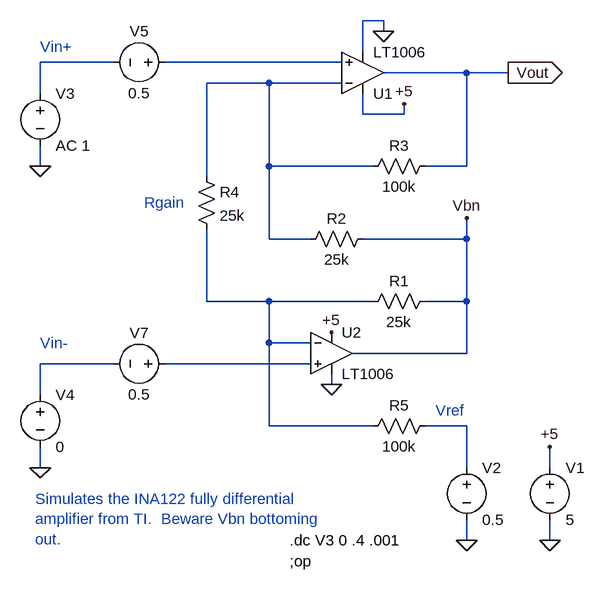
[diagram p0: schematic diffamp_vref.asc]
diffamp_vref.asc, the LTspice schematic file:
Version 4
SHEET 1 880 680
WIRE 224 -288 192 -288
WIRE 224 -272 224 -288
WIRE 192 -240 192 -288
WIRE -192 -224 -304 -224
WIRE 160 -224 -112 -224
WIRE 352 -208 224 -208
WIRE 416 -208 352 -208
WIRE 48 -192 -48 -192
WIRE 160 -192 48 -192
WIRE -304 -176 -304 -224
WIRE 192 -144 192 -176
WIRE 256 -144 256 -160
WIRE 256 -144 192 -144
WIRE -304 -64 -304 -96
WIRE 48 -64 48 -192
WIRE 208 -64 48 -64
WIRE 352 -64 352 -208
WIRE 352 -64 288 -64
WIRE -48 -48 -48 -192
WIRE 48 48 48 -64
WIRE 112 48 48 48
WIRE 352 48 352 16
WIRE 352 48 192 48
WIRE -48 144 -48 32
WIRE 48 144 -48 144
WIRE 208 144 48 144
WIRE 352 144 352 48
WIRE 352 144 288 144
WIRE 48 208 48 144
WIRE 112 208 48 208
WIRE 352 224 352 144
WIRE 352 224 176 224
WIRE -192 240 -304 240
WIRE 112 240 -112 240
WIRE 144 272 144 256
WIRE -304 288 -304 240
WIRE 48 336 48 208
WIRE 208 336 48 336
WIRE 352 336 288 336
WIRE -304 400 -304 368
WIRE 352 400 352 336
WIRE 480 400 480 368
WIRE 352 512 352 480
WIRE 480 512 480 480
FLAG 480 512 0
FLAG 480 368 +5
FLAG 144 272 0
FLAG 224 -272 0
FLAG 144 192 +5
FLAG 256 -160 +5
FLAG 352 512 0
FLAG -304 -64 0
FLAG 352 16 Vbn
FLAG 416 -208 Vout
IOPIN 416 -208 Out
FLAG -304 400 0
SYMBOL voltage 480 384 R0
WINDOW 123 0 0 Left 2
WINDOW 39 0 0 Left 2
SYMATTR InstName V1
SYMATTR Value 5
SYMBOL res 192 160 R270
WINDOW 0 32 56 VTop 2
WINDOW 3 0 56 VBottom 2
SYMATTR InstName R1
SYMATTR Value 25k
SYMBOL res 96 64 R270
WINDOW 0 32 56 VTop 2
WINDOW 3 0 56 VBottom 2
SYMATTR InstName R2
SYMATTR Value 25k
SYMBOL res 192 -48 R270
WINDOW 0 32 56 VTop 2
WINDOW 3 0 56 VBottom 2
SYMATTR InstName R3
SYMATTR Value 100k
SYMBOL res 192 352 R270
WINDOW 0 32 56 VTop 2
WINDOW 3 0 56 VBottom 2
SYMATTR InstName R5
SYMATTR Value 100k
SYMBOL voltage 352 384 R0
WINDOW 123 0 0 Left 2
WINDOW 39 0 0 Left 2
SYMATTR InstName V2
SYMATTR Value 0.5
SYMBOL voltage -304 -192 R0
WINDOW 123 0 0 Left 2
WINDOW 39 0 0 Left 2
SYMATTR InstName V3
SYMATTR Value AC 1
SYMBOL voltage -304 272 R0
WINDOW 123 0 0 Left 2
WINDOW 39 0 0 Left 2
SYMATTR InstName V4
SYMATTR Value 0
SYMBOL res -64 -64 R0
SYMATTR InstName R4
SYMATTR Value 25k
SYMBOL voltage -96 -224 R90
WINDOW 0 -32 56 VBottom 2
WINDOW 3 32 56 VTop 2
WINDOW 123 0 0 Left 2
WINDOW 39 0 0 Left 2
SYMATTR InstName V5
SYMATTR Value 0.5
SYMBOL voltage -96 240 R90
WINDOW 0 -32 56 VBottom 2
WINDOW 3 32 56 VTop 2
WINDOW 123 0 0 Left 2
WINDOW 39 0 0 Left 2
SYMATTR InstName V7
SYMATTR Value 0.5
SYMBOL Opamps\\LT1006 192 -144 M180
SYMATTR InstName U1
SYMBOL Opamps\\LT1006 144 160 R0
SYMATTR InstName U2
TEXT -304 -248 Left 2 ;Vin+
TEXT 80 512 Left 2 !.dc V3 0 .4 .001
TEXT 80 544 Left 2 !;op
TEXT -144 -8 Left 2 ;Rgain
TEXT 304 312 Left 2 ;Vref
TEXT -304 208 Left 2 ;Vin-
TEXT -312 448 Left 2 ;Simulates the INA122 fully differential\namplifier from TI.  Beware Vbn bottoming\nout.

The netlist it stands for:
* diffamp_vref.asc
V1 +5 0 5
R1 N004 Vbn 25k
R2 N003 Vbn 25k
R3 N003 Vout 100k
R5 N004 N007 100k
V2 N007 0 0.5
V3 N001 0 AC 1
V4 N005 0 0
R4 N003 N004 25k
V5 N002 N001 0.5
V7 N006 N005 0.5
XU1 N002 N003 +5 0 Vout LT1006  ; pins In+ In- V+ V- OUT
XU2 N006 N004 +5 0 Vbn LT1006  ; pins In+ In- V+ V- OUT
* Vin+
.dc V3 0 .4 .001
;op
* Rgain
* Vref
* Vin-
* Simulates the INA122 fully differential
* amplifier from TI.  Beware Vbn bottoming
* out.
.lib LTC.lib
.backanno
.end